# Altium project UGS_Sec.PrjPcb
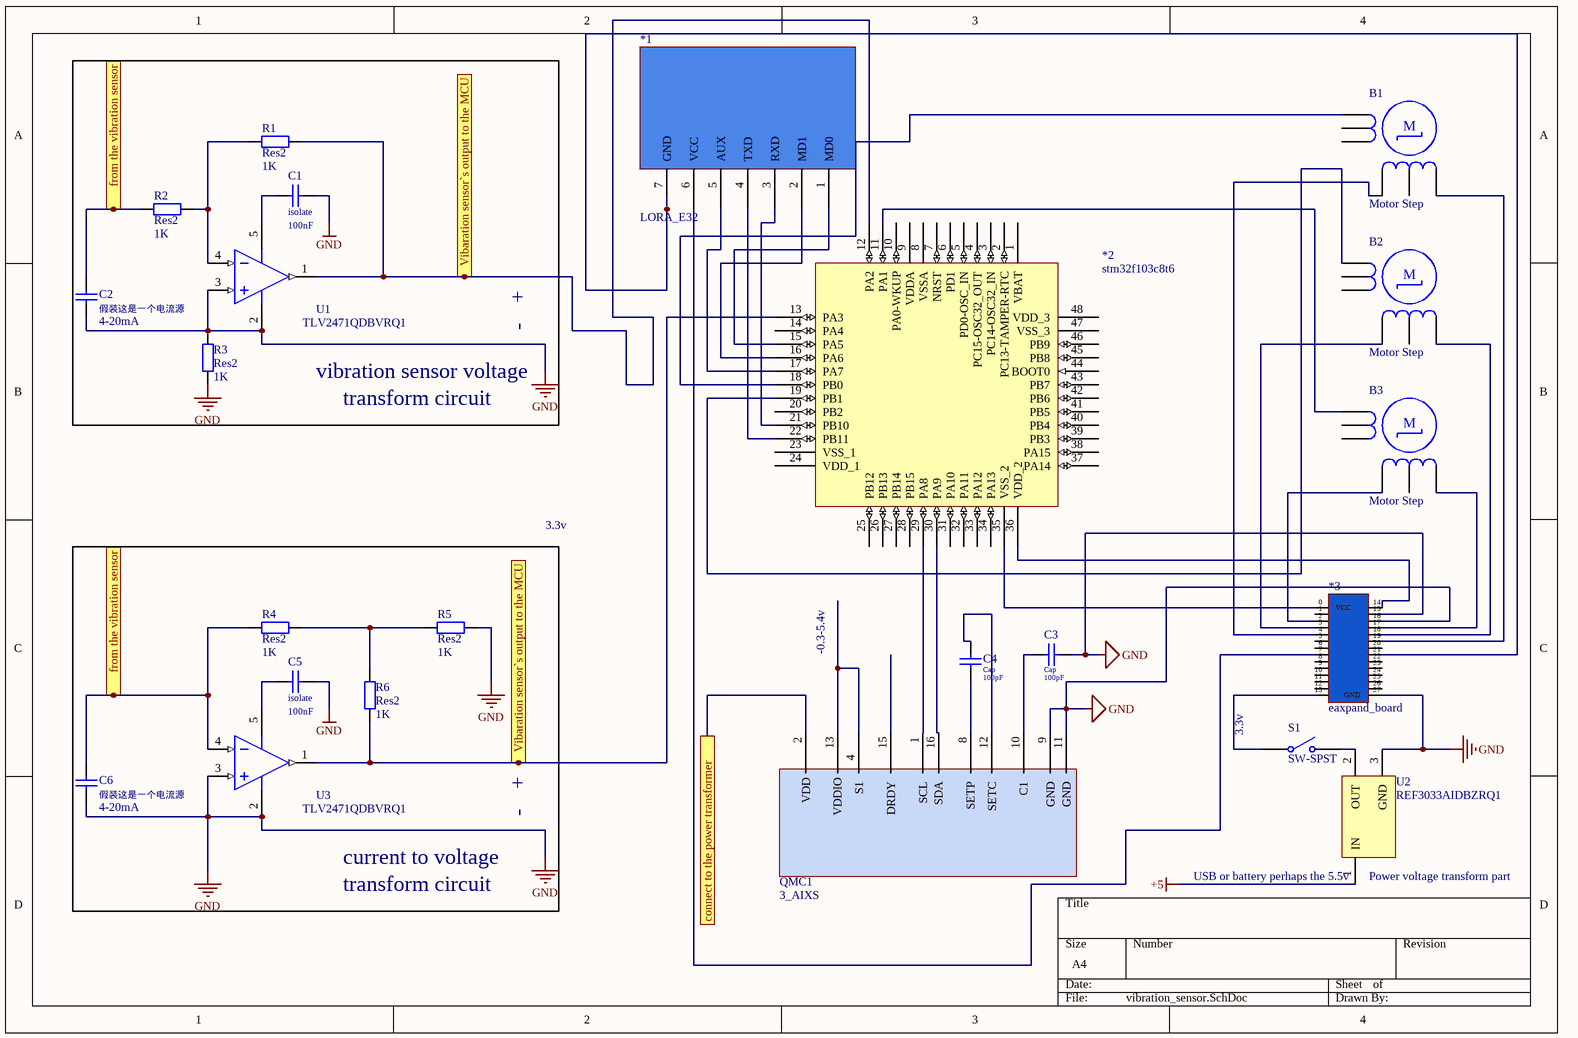
[diagram p0: vibration_sensor.SchDoc]
2 sheets, 48 parts. Net scope: flat (ports and power ports of the same name join across sheets).
Sheets:
  vibration_sensor.SchDoc
  part.SchDoc

## Sheet vibration_sensor.SchDoc
size A4

### Parts
*1  LORA_E32  [LORA_AS62-T20]
*2  stm32f103c8t6
*3  eaxpand_board  [expand_board]
B1  Motor Step  [DIP-6]
B2  Motor Step  [DIP-6]
B3  Motor Step  [DIP-6]
C1  isolate  value 100nF  [RAD-0.3]
C2  假装这是一个电流源  value 4-20mA  [RAD-0.3]
C3  Cap  value 100pF  [RAD-0.3]
C4  Cap  value 100pF  [RAD-0.3]
C5  isolate  value 100nF  [RAD-0.3]
C6  假装这是一个电流源  value 4-20mA  [RAD-0.3]
QMC1  3_AIXS
R1  Res2  value 1K  [AXIAL-0.4]
R2  Res2  value 1K  [AXIAL-0.4]
R3  Res2  value 1K  [AXIAL-0.4]
R4  Res2  value 1K  [AXIAL-0.4]
R5  Res2  value 1K  [AXIAL-0.4]
R6  Res2  value 1K  [AXIAL-0.4]
S1  SW-SPST  [SPST-2]
U1  TLV2471QDBVRQ1  [TI-DBV5_N]
U2  REF3033AIDBZRQ1  [TI-DBZ3_N]
U3  TLV2471QDBVRQ1  [TI-DBV5_N]

### Ports
connect to the power transformer, from the vibration sensor, Vibaration sensor`s output to the MCU

### Nets
+5: U2.1(IN)
GND: *3.15 *3.16 *3.27(GND) C1.1 C2.1 C3.1 C5.1 C6.1 QMC1.9(GND) QMC1.11(GND) R3.1 R3.2 R5.2 U1.2(GND) U1.3(IN+) U2.3(GND) U3.2(GND) U3.3(IN+)
Net*1_1: *1.1(MD0) *2.15(PA5)
Net*1_2: *1.2(MD1) *2.16(PA6)
Net*1_3: *1.3(RXD) *2.21(PB10)
Net*1_4: *1.4(TXD) *2.22(PB11)
Net*1_5: *1.5(AUX) *2.17(PA7)
Net*1_6: *1.6(VCC) *3.7
Net*1_7: *1.7(GND) *3.21
Net*2_11: *2.11(PA1) B3.1
Net*2_12: *2.12(PA2) *2.13(PA3) R1.1 R6.1 U1.1(OUT) U3.1(OUT) ; port Vibaration sensor`s output to the MCU
Net*2_18: *2.18(PB0) B1.1
Net*2_19: *2.19(PB1) B2.1
Net*2_29: *2.29(PA8) QMC1.1(SCL)
Net*2_30: *2.30(PA9) QMC1.16(SDA)
Net*2_35: *2.35(VSS_2) *3.0(VCC)
Net*2_36: *2.36(VDD_2) *3.14
Net*3_2: *3.2 B3.4
Net*3_3: *3.3 B2.4
Net*3_4: *3.4 B1.4
Net*3_13: *3.13 S1.1(COMMON)
Net*3_17: *3.17 B3.6
Net*3_18: *3.18 B2.6
Net*3_19: *3.19 B1.6
NetC1_2: C1.2 U1.5(VDD)
NetC2_2: C2.2 C6.2 R2.1 R4.2 U3.4(IN-) ; port from the vibration sensor
NetC3_2: C3.2 QMC1.10(C1)
NetC4_1: C4.1 QMC1.8(SETP)
NetC4_2: C4.2 QMC1.12(SETC)
NetC5_2: C5.2 U3.5(VDD)
NetQMC1_2: QMC1.2(VDD) ; port connect to the power transformer
NetQMC1_4: QMC1.4(S1) QMC1.13(VDDIO)
NetR1_2: R1.2 R2.2 U1.4(IN-)
NetR4_1: R4.1 R5.1 R6.2
NetS1_2: S1.2(NO) U2.2(OUT)

Not connected (* = marked no-connect by the designer): *2 1(VBAT) 2(PC13-TAMPER-RTC) 3(PC14-OSC32_IN) 4(PC15-OSC32_OUT) 5(PD0-OSC_IN) 6(PD1) 7(NRST) 8(VSSA) 9(VDDA) 10(PA0-WKUP) 14(PA4) 20(PB2) 23(VSS_1) 24(VDD_1) 25(PB12) 26(PB13) 27(PB14) 28(PB15) 31(PA10) 32(PA11) 33(PA12) 34(PA13) 37(PA14) 38(PA15) 39(PB3) 40(PB4) 41(PB5) 42(PB6) 43(PB7) 44(BOOT0) 45(PB8) 46(PB9) 47(VSS_3) 48(VDD_3); *3 1 5(\) 6 8 9 10 11 12 20 22 23 24 25 26; B1 2 3 5; B2 2 3 5; B3 2 3 5; QMC1 15(DRDY)

### Notes on the sheet
- +
- vibration sensor voltage
- -
- transform circuit
- 3.3v
- -0.3-5.4v
- (near S1) 3.3v
- current to voltage
- (near U2) USB or battery perhaps the 5.5v
- (near U2) Power voltage transform part
- (in symbol Motor Step) M

### Library data of the parts
*1 = LORA_E32: EBYTE_USE_SEMTCH_CORE
B1-B3 = Motor Step: Motor Stepper; Published: 24-Mar-1999; LatestRevisionDate: 17-Jul-2002; LatestRevisionNote: Re-released for DXP Platform.; PackageReference: DIP-6; Publisher: Altium Limited; Code_JEDEC: MO-001-AM
C1-C6 = Cap: Capacitor; Published: 8-Jun-2000; LatestRevisionDate: 17-Jul-2002; LatestRevisionNote: Re-released for DXP Platform.; PackageReference: RAD-0.3; Publisher: Altium Limited; PackageDescription: Radial Cap, Thru-Hole; 2 Leads; 0.3 in Pin Spacing
QMC1 = QMC5883L
R1-R6 = Res2: Resistor; Published: 8-Jun-2000; LatestRevisionDate: 17-Jul-2002; LatestRevisionNote: Re-released for DXP Platform.; PackageReference: AXIAL-0.4; Publisher: Altium Limited; PackageDescription: Axial Device, Thru-Hole; 2 Leads; 0.4 in Pin Spacing
S1 = SW-SPST: Single-Pole, Single-Throw Switch; Published: 24-Mar-1999; LatestRevisionDate: 17-Jul-2002; LatestRevisionNote: Re-released for DXP Platform.; PackageReference: SPST-2; Publisher: Altium Limited; PackageDescription: Switch; 2 Leads
U1 U3 = TLV2471QDBVRQ1: Automotive Catalog 600 uA/Ch 2.8 MHz Rail-to-Rail Input / Output High-Drive Operational Amplifier, 2.7 to 6 V, -40 to 125 degC, 5-pin SOT23 (DBV5), Green (RoHS & no Sb/Br); Manufacturer: Texas Instruments; CMRR(Min)(dB): 58; GBW(Typ)(MHz): 2.8; IIB(Max)(pA): 50; Iq per channel(Max)(mA): 0.75; Number of Channels: 1; Offset Drift(Typ)(uV/C): 0.4; Packing: LARGE T&R; Slew Rate(Typ)(V/us): 1.4; Sub Family: Low Supply Voltage Amplifier (<=2.7V), Precision Amplifier; Total Supply Voltage(Max)(+5V is 5, +/-5V is 10): 6; Total Supply Voltage(Min)(+5V is 5, +/-5V is 10): 2.7; Vio (25C)(Max)(mV): 2.2; DatasheetVersion: SGLS180B; PackageVersion: 4073253-4/K, 03/2006; PackageReference: DBV5; PackageDescription: 5-Pin Plastic Small Outline, Body 1.6 x 2.9 mm, Pitch 0.95 mm; Eco-Plan: Green (RoHS & no Sb/Br); Rating: Automotive; Mounting Technology: Surface Mount; Code_JEDEC: MO-178; PartNumber: TLV2471QDBVRQ1; ComponentLink1Description: Manufacturer URL; ComponentLink1URL: http://www.ti.com/; ComponentLink2Description: Datasheet; ComponentLink2URL: http://www.ti.com/lit/ds/symlink/tlv2471-q1.pdf; ComponentLink3Description: Package Specification; ComponentLink3URL: http://www.ti.com/litv/pdf/mpds018i
U2 = REF3033AIDBZRQ1: Automotive Catalog, 3.3V 50 ppm / degC, 50 uA in Series (Bandgap) Voltage Reference, -40 to 85 degC, 3-pin SOT-23 (DBZ), Green (RoHS & no Sb/Br); Manufacturer: Texas Instruments; Initial Accuracy @ 25/deg C(%): 0.2; SubFamily: Series Voltage Reference; Temp Coeff(Max)(ppm/ degree C): 65; Temp Coeff(Typ)(ppm/ degree C): 30; VI(Max)(V): 5.5; VO(V): 3.3; DatasheetVersion: SBVS131; PackageVersion: 4203227/B; PackageReference: DBZ3; PackageDescription: 3-Pin Plastic Small Outline, Body 2.92 x 1.3 mm, Pitch 0.95 mm; Supplier 1: Digi-Key; Supplier Part Number 1: 296-27477-2-ND; Supplier 2: Digi-Key; Supplier Part Number 2: 296-27477-1-ND; Supplier 3: Digi-Key; Supplier Part Number 3: 296-27477-6-ND; Supplier 4: Newark; Supplier Part Number 4: 79R8280; Supplier 5: Mouser; Supplier Part Number 5: 595-REF3033AIDBZRQ1; Eco-Plan: Green (RoHS & no Sb/Br); Rating: Automotive; Mounting Technology: Surface Mount; Code_JEDEC: TO-236; PartNumber: REF3033AIDBZRQ1; ComponentLink1Description: Manufacturer URL; ComponentLink1URL: http://www.ti.com/; ComponentLink2Description: Datasheet; ComponentLink2URL: http://www.ti.com/general/docs/lit/getliterature.tsp?genericPartNumber=REF3033-Q1&fileType=pdf; ComponentLink3Description: Package Specification; ComponentLink3URL: http://www.ti.com/litv/pdf/mpds108a

## Sheet part.SchDoc
size A4
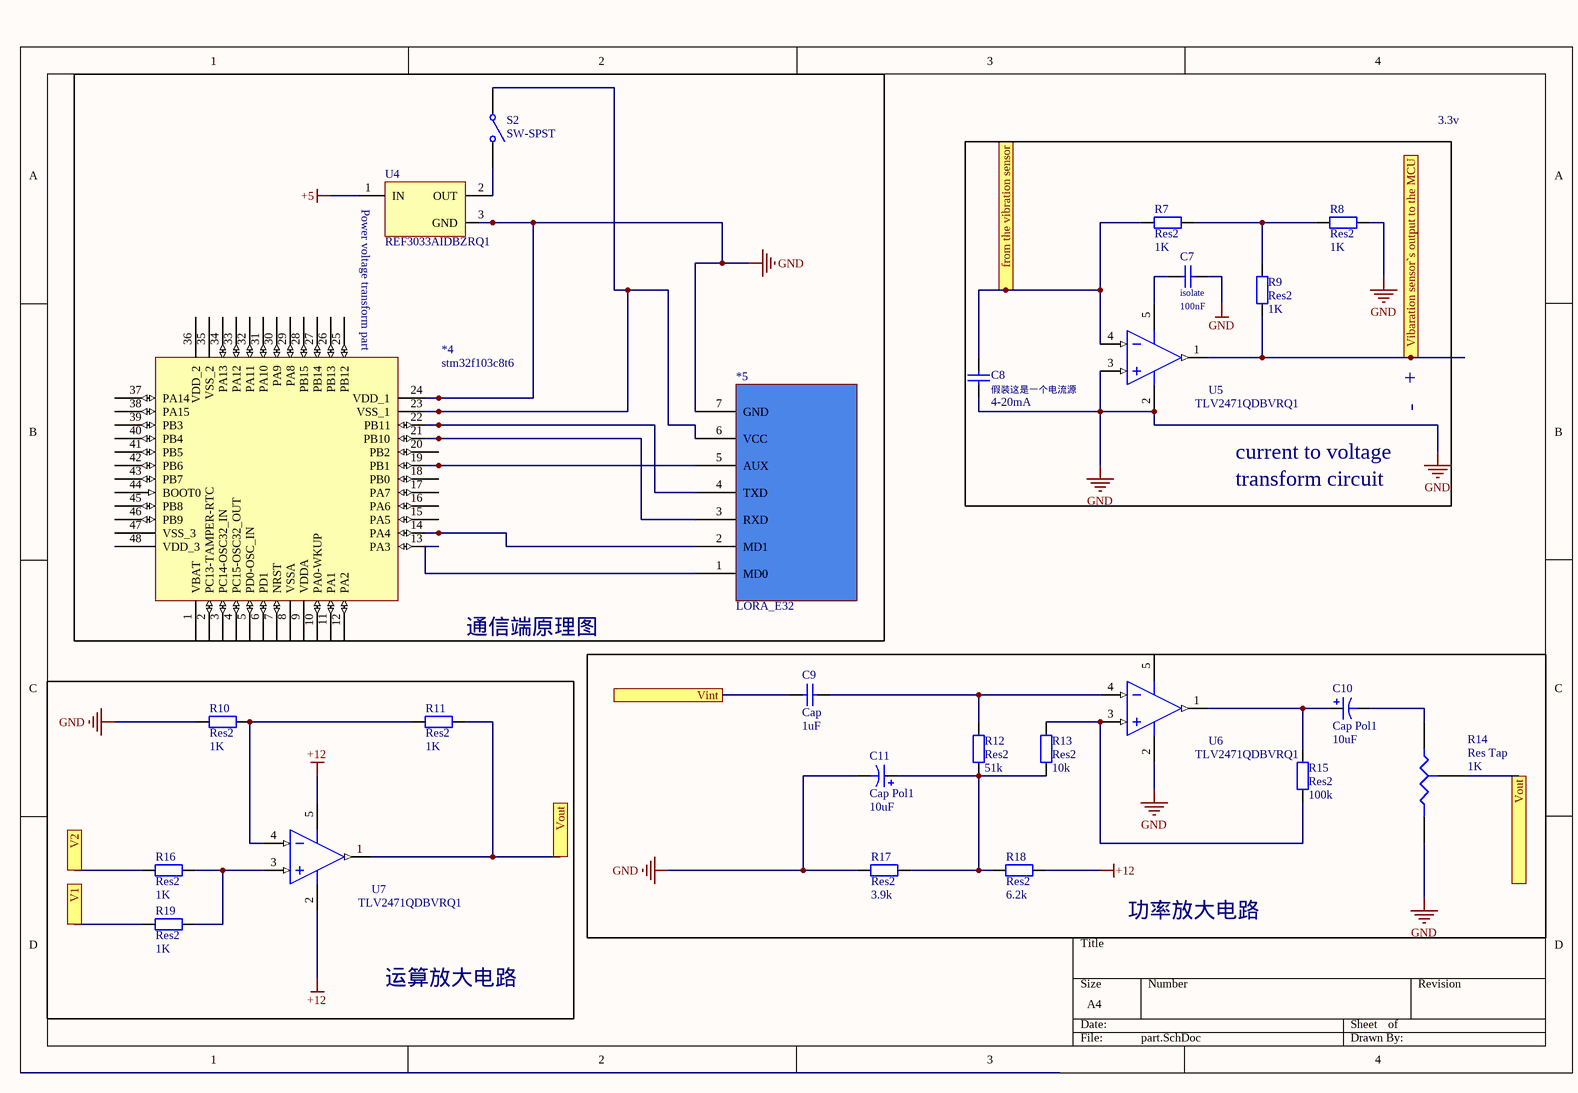
[diagram p1: part.SchDoc]

### Parts
*4  stm32f103c8t6
*5  LORA_E32  [LORA_AS62-T20]
C7  isolate  value 100nF  [RAD-0.3]
C8  假装这是一个电流源  value 4-20mA  [RAD-0.3]
C9  Cap  value 1uF  [RAD-0.3]
C10  Cap Pol1  value 10uF  [RB7.6-15]
C11  Cap Pol1  value 10uF  [RB7.6-15]
R7  Res2  value 1K  [AXIAL-0.4]
R8  Res2  value 1K  [AXIAL-0.4]
R9  Res2  value 1K  [AXIAL-0.4]
R10  Res2  value 1K  [AXIAL-0.4]
R11  Res2  value 1K  [AXIAL-0.4]
R12  Res2  value 51k  [AXIAL-0.4]
R13  Res2  value 10k  [AXIAL-0.4]
R14  Res Tap  value 1K  [VR3]
R15  Res2  value 100k  [AXIAL-0.4]
R16  Res2  value 1K  [AXIAL-0.4]
R17  Res2  value 3.9k  [AXIAL-0.4]
R18  Res2  value 6.2k  [AXIAL-0.4]
R19  Res2  value 1K  [AXIAL-0.4]
S2  SW-SPST  [SPST-2]
U4  REF3033AIDBZRQ1  [TI-DBZ3_N]
U5  TLV2471QDBVRQ1  [TI-DBV5_N]
U6  TLV2471QDBVRQ1  [TI-DBV5_N]
U7  TLV2471QDBVRQ1  [TI-DBV5_N]

### Blocks framed on the sheet
通信端原理图: *4 *5 S2 U4
功率放大电路: C9-C11 R12-R15 R17 R18 U6
运算放大电路: R10 R11 R16 R19 U7

### Ports
from the vibration sensor, V1, V2, Vibaration sensor`s output to the MCU, Vint, Vout

### Nets
+5: U4.1(IN)
+12: R18.1 U7.2(GND) U7.5(VDD)
GND: *4.24(VDD_1) *5.7(GND) C7.1 C8.1 C11.2 R8.2 R10.1 R14.2(B) R17.2 U4.3(GND) U5.2(GND) U5.3(IN+) U6.2(GND)
Net*2_12: R9.1 U5.1(OUT) ; port Vibaration sensor`s output to the MCU
Net*4_13: *4.13(PA3) *5.1(MD0)
Net*4_14: *4.14(PA4) *5.2(MD1)
Net*4_19: *4.19(PB1) *5.5(AUX)
Net*4_21: *4.21(PB10) *5.3(RXD)
Net*4_22: *4.22(PB11) *5.4(TXD)
Net*4_23: *4.23(VSS_1) *5.6(VCC) S2.1(COMMON)
NetC2_2: C8.2 R7.2 U5.4(IN-) ; port from the vibration sensor
NetC7_2: C7.2 U5.5(VDD)
NetC9_1: C9.1 ; port Vint
NetC9_2: C9.2 R12.2 U6.4(IN-)
NetC10_1: C10.1 R15.2 U6.1(OUT)
NetC10_2: C10.2 R14.1(A)
NetC11_1: C11.1 R12.1 R13.1 R17.1 R18.2
NetR7_1: R7.1 R8.1 R9.2
NetR10_2: R10.2 R11.1 U7.4(IN-)
NetR11_2: R11.2 R14.3(TAP) U7.1(OUT) ; port Vout
NetR13_2: R13.2 R15.1 U6.3(IN+)
NetR16_1: R16.1 ; port V2
NetR16_2: R16.2 R19.2 U7.3(IN+)
NetR19_1: R19.1 ; port V1
NetS2_2: S2.2(NO) U4.2(OUT)

Not connected (* = marked no-connect by the designer): *4 1(VBAT) 2(PC13-TAMPER-RTC) 3(PC14-OSC32_IN) 4(PC15-OSC32_OUT) 5(PD0-OSC_IN) 6(PD1) 7(NRST) 8(VSSA) 9(VDDA) 10(PA0-WKUP) 11(PA1) 12(PA2) 15(PA5) 16(PA6) 17(PA7) 18(PB0) 20(PB2) 25(PB12) 26(PB13) 27(PB14) 28(PB15) 29(PA8) 30(PA9) 31(PA10) 32(PA11) 33(PA12) 34(PA13) 35(VSS_2) 36(VDD_2) 37(PA14) 38(PA15) 39(PB3) 40(PB4) 41(PB5) 42(PB6) 43(PB7) 44(BOOT0) 45(PB8) 46(PB9) 47(VSS_3) 48(VDD_3); U6 5(VDD)

### Notes on the sheet
- 3.3v
- (near *4) Power voltage transform part
- +
- -
- current to voltage
- transform circuit

### Library data of the parts
*5 = LORA_E32: EBYTE_USE_SEMTCH_CORE
C7-C9 = Cap: Capacitor; Published: 8-Jun-2000; LatestRevisionDate: 17-Jul-2002; LatestRevisionNote: Re-released for DXP Platform.; PackageReference: RAD-0.3; Publisher: Altium Limited; PackageDescription: Radial Cap, Thru-Hole; 2 Leads; 0.3 in Pin Spacing
C10 C11 = Cap Pol1: Polarized Capacitor (Radial); Published: 8-Jun-2000; LatestRevisionDate: 17-Jul-2002; LatestRevisionNote: Re-released for DXP Platform.; PackageReference: RB7.6-15; Publisher: Altium Limited; PackageDescription: Polarized Capacitor (Radial); 2 Leads
R7-R13 R15-R19 = Res2: Resistor; Published: 8-Jun-2000; LatestRevisionDate: 17-Jul-2002; LatestRevisionNote: Re-released for DXP Platform.; PackageReference: AXIAL-0.4; Publisher: Altium Limited; PackageDescription: Axial Device, Thru-Hole; 2 Leads; 0.4 in Pin Spacing
R14 = Res Tap: Tapped Resistor; Sim Note: Enter the Resistance value and the set point into parameter fields.; Set Position: 0.5; Published: 24-Mar-1999; LatestRevisionDate: 17-Jul-2002; LatestRevisionNote: Re-released for DXP Platform.; PackageReference: VR3; Publisher: Altium Limited; PackageDescription: Variable Resistor, Thru-Hole; 3 Leads
S2 = SW-SPST: Single-Pole, Single-Throw Switch; Published: 24-Mar-1999; LatestRevisionDate: 17-Jul-2002; LatestRevisionNote: Re-released for DXP Platform.; PackageReference: SPST-2; Publisher: Altium Limited; PackageDescription: Switch; 2 Leads
U4 = REF3033AIDBZRQ1: as U2 on sheet vibration_sensor; DatasheetVersion: SBVS131; PackageVersion: 4203227/B; PackageReference: DBZ3; PackageDescription: 3-Pin Plastic Small Outline, Body 2.92 x 1.3 mm, Pitch 0.95 mm; Supplier 1: Digi-Key; Supplier Part Number 1: 296-27477-2-ND; Supplier 2: Digi-Key; Supplier Part Number 2: 296-27477-1-ND; Supplier 3: Digi-Key; Supplier Part Number 3: 296-27477-6-ND; Supplier 4: Newark; Supplier Part Number 4: 79R8280; Supplier 5: Mouser; Supplier Part Number 5: 595-REF3033AIDBZRQ1; Eco-Plan: Green (RoHS & no Sb/Br); Rating: Automotive; Mounting Technology: Surface Mount; Code_JEDEC: TO-236; PartNumber: REF3033AIDBZRQ1; ComponentLink1Description: Manufacturer URL; ComponentLink1URL: http://www.ti.com/; ComponentLink2Description: Datasheet; ComponentLink2URL: http://www.ti.com/general/docs/lit/getliterature.tsp?genericPartNumber=REF3033-Q1&fileType=pdf; ComponentLink3Description: Package Specification; ComponentLink3URL: http://www.ti.com/litv/pdf/mpds108a
U5-U7 = TLV2471QDBVRQ1: as U1 on sheet vibration_sensor; DatasheetVersion: SGLS180B; PackageVersion: 4073253-4/K, 03/2006; PackageReference: DBV5; PackageDescription: 5-Pin Plastic Small Outline, Body 1.6 x 2.9 mm, Pitch 0.95 mm; Eco-Plan: Green (RoHS & no Sb/Br); Rating: Automotive; Mounting Technology: Surface Mount; Code_JEDEC: MO-178; PartNumber: TLV2471QDBVRQ1; ComponentLink1Description: Manufacturer URL; ComponentLink1URL: http://www.ti.com/; ComponentLink2Description: Datasheet; ComponentLink2URL: http://www.ti.com/lit/ds/symlink/tlv2471-q1.pdf; ComponentLink3Description: Package Specification; ComponentLink3URL: http://www.ti.com/litv/pdf/mpds018i

## Nets that join several sheets
+5: vibration_sensor (U2.1), part (U4.1)
GND: vibration_sensor (18 pins), part (13 pins)
Net*2_12: vibration_sensor (6 pins), part (R9.1 U5.1)
NetC2_2: vibration_sensor (5 pins), part (C8.2 R7.2 U5.4)